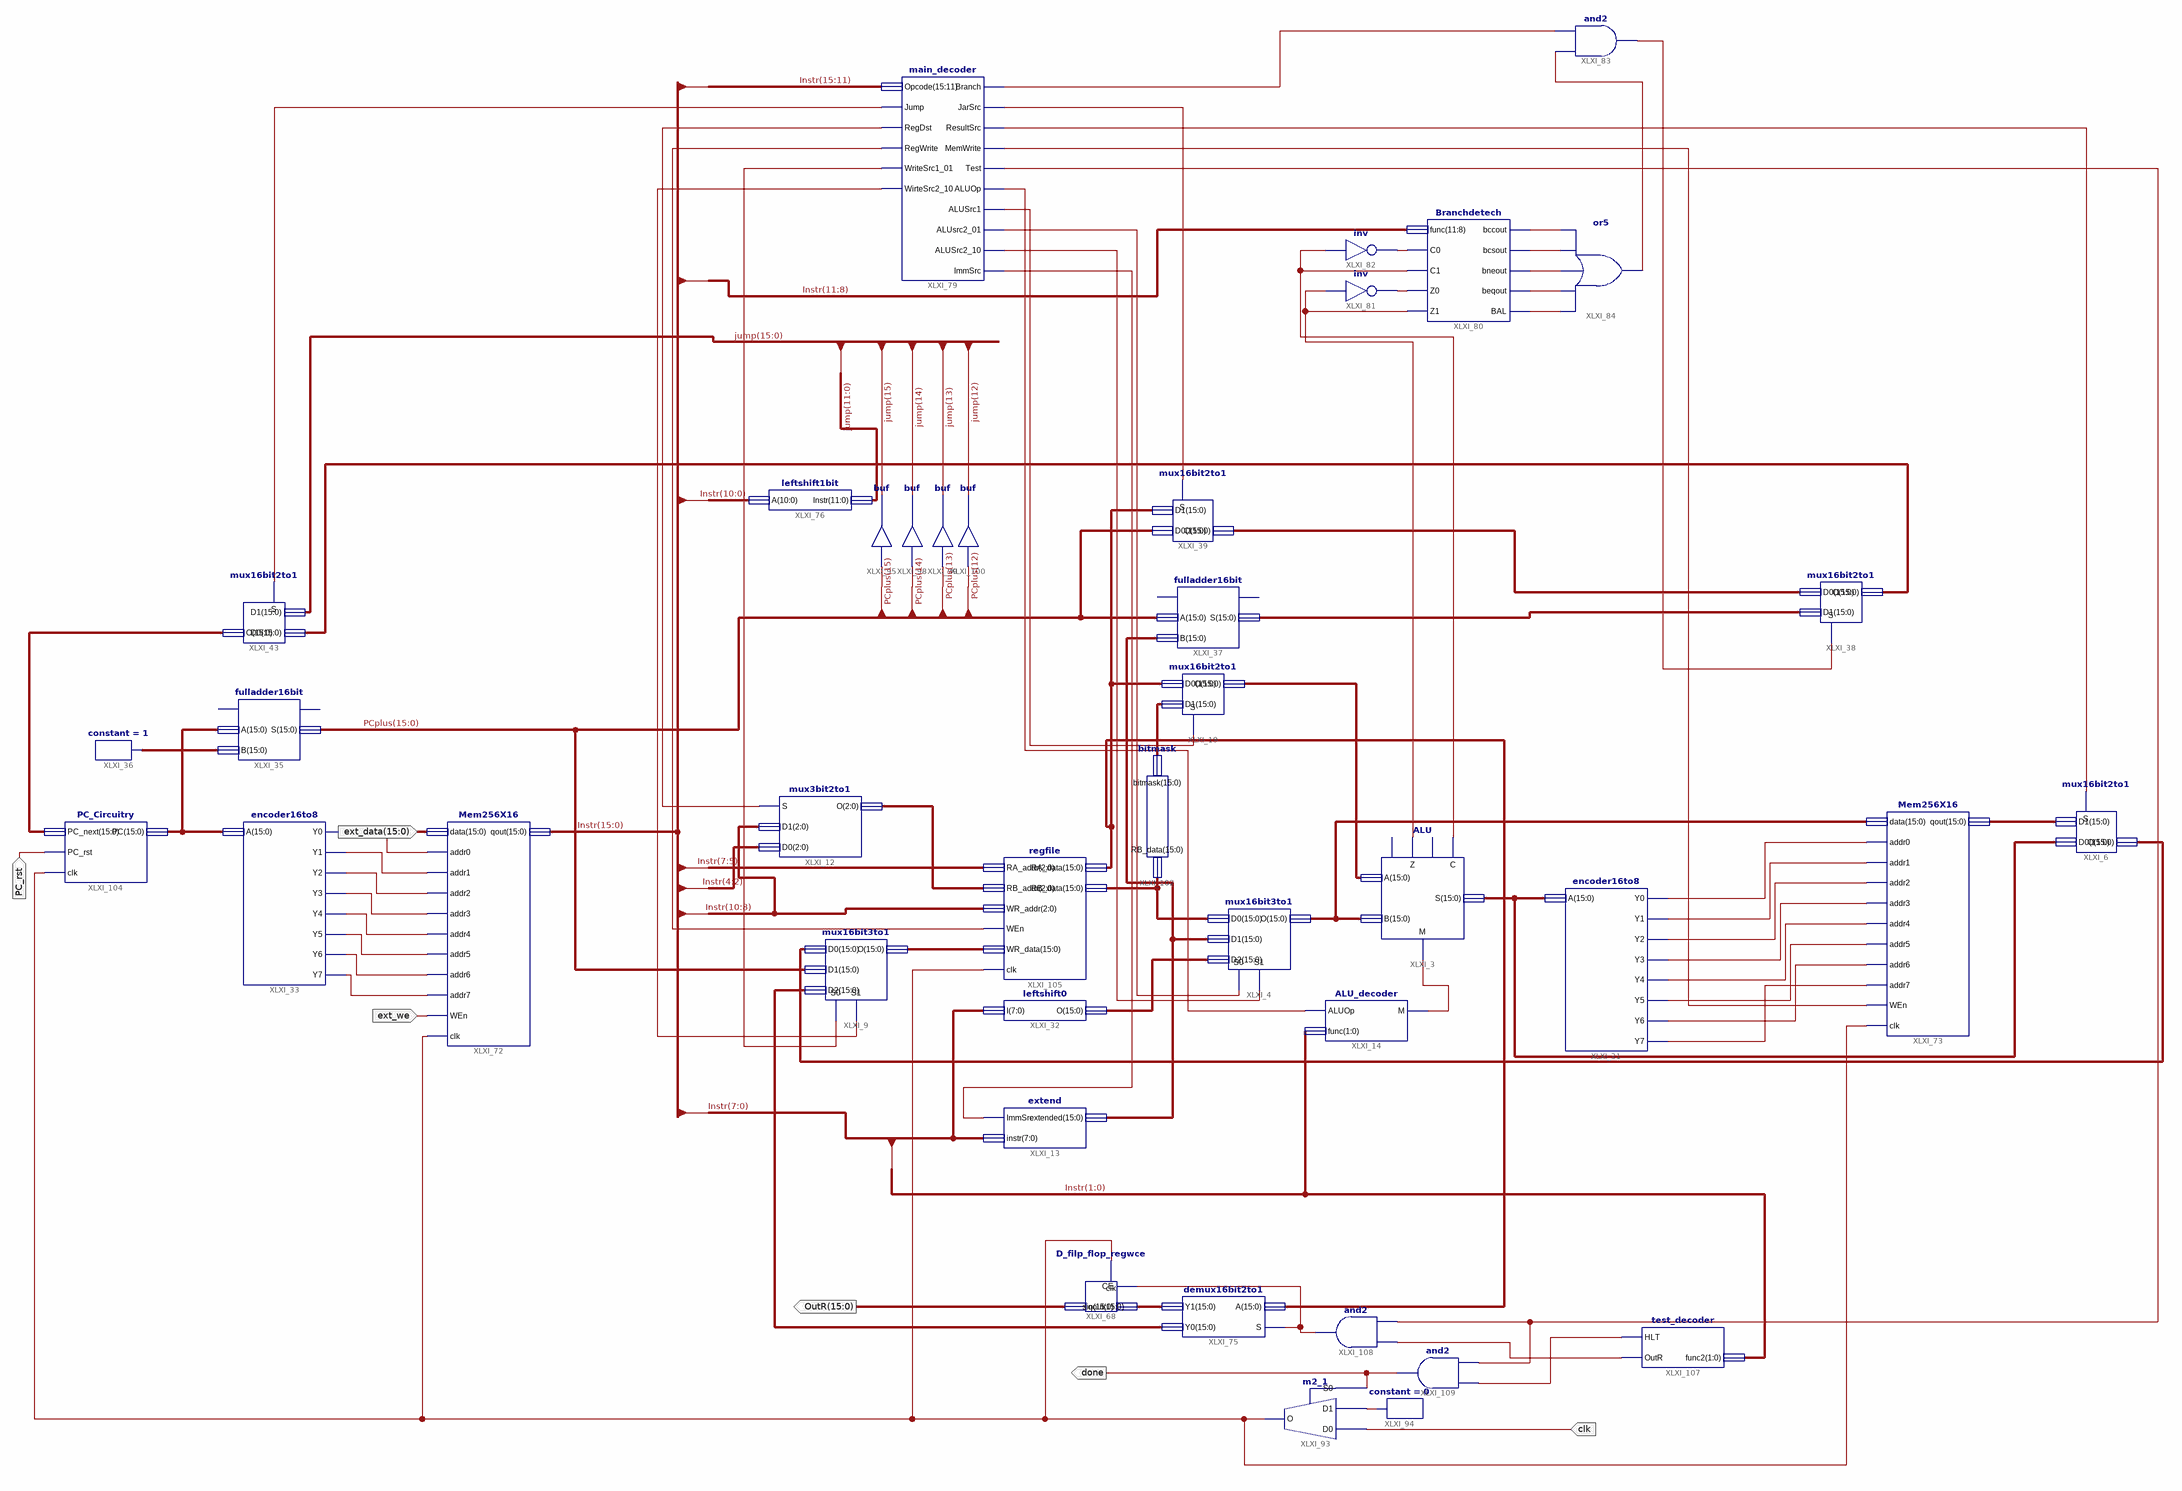
[diagram p0: schematic sheet 1]
// Xilinx ISE schematic RISCV16bit.sch (spartan3e) as structural Verilog: 40 symbols, 6 ports
module RISCV16bit (
  input  clk,
  input  [15:0] ext_data,
  input  PC_rst,
  input  ext_we,
  output done,
  output [15:0] OutR
);

  wire XLXN_18, XLXN_32, XLXN_33, XLXN_34, XLXN_35, XLXN_36, XLXN_37, XLXN_38, XLXN_39, XLXN_43, XLXN_44,
       XLXN_45, XLXN_46, XLXN_47, XLXN_48, XLXN_49, XLXN_50, XLXN_128, XLXN_130, XLXN_131, XLXN_132,
       XLXN_135, XLXN_136, XLXN_137, XLXN_138, XLXN_139, XLXN_140, XLXN_141, XLXN_146, XLXN_147, XLXN_148,
       XLXN_149, XLXN_150, XLXN_151, XLXN_152, XLXN_153, XLXN_154, XLXN_155, XLXN_156, XLXN_157, XLXN_158,
       XLXN_163, XLXN_196, XLXN_202, XLXN_218, XLXN_219, XLXN_220, XLXN_224;
  wire [2:0] XLXN_15;
  wire [15:0] Instr, jump, PCplus, XLXN_1, XLXN_2, XLXN_4, XLXN_5, XLXN_6, XLXN_7, XLXN_21, XLXN_41, XLXN_42,
       XLXN_52, XLXN_53, XLXN_57, XLXN_61, XLXN_63, XLXN_64, XLXN_114, XLXN_199, XLXN_203, XLXN_225;

  ALU XLXI_3 (.C(XLXN_148), .Z(XLXN_149), .M(XLXN_18), .S(XLXN_5), .B(XLXN_1), .A(XLXN_21));  // open: N, V
  mux16bit3to1 XLXI_4 (.D0(XLXN_2), .D1(XLXN_203), .D2(XLXN_41), .O(XLXN_1), .S0(XLXN_137), .S1(XLXN_138));
  mux16bit3to1 XLXI_9 (.D0(XLXN_7), .D1(PCplus), .D2(XLXN_225), .O(XLXN_6), .S0(XLXN_130), .S1(XLXN_131));
  mux3bit2to1 XLXI_12 (.D0(Instr[4:2]), .D1(Instr[10:8]), .O(XLXN_15), .S(XLXN_132));
  extend XLXI_13 (.extended(XLXN_203), .ImmSrc(XLXN_139), .instr(Instr[7:0]));
  ALU_decoder XLXI_14 (.ALUOp(XLXN_140), .func(Instr[1:0]), .M(XLXN_18));
  mux16bit2to1 XLXI_6 (.D0(XLXN_5), .D1(XLXN_4), .O(XLXN_7), .S(XLXN_158));
  encoder16to8 XLXI_31 (
    .A(XLXN_5), .Y0(XLXN_32), .Y1(XLXN_33), .Y2(XLXN_34), .Y3(XLXN_35), .Y4(XLXN_36), .Y5(XLXN_37),
    .Y6(XLXN_38), .Y7(XLXN_39));
  leftshift0 XLXI_32 (.I(Instr[7:0]), .O(XLXN_41));
  encoder16to8 XLXI_33 (
    .A(XLXN_42), .Y0(XLXN_43), .Y1(XLXN_44), .Y2(XLXN_45), .Y3(XLXN_46), .Y4(XLXN_47), .Y5(XLXN_48),
    .Y6(XLXN_49), .Y7(XLXN_50));
  mux16bit2to1 XLXI_19 (.D0(XLXN_53), .D1(XLXN_52), .O(XLXN_21), .S(XLXN_136));
  fulladder16bit XLXI_35 (.A(XLXN_42), .B(XLXN_57), .S(PCplus));  // open: cin, cout
  constant #(.CValue("1")) XLXI_36 (.O(XLXN_57));
  fulladder16bit XLXI_37 (.A(PCplus), .B(XLXN_203), .S(XLXN_61));  // open: cin, cout
  mux16bit2to1 XLXI_38 (.D0(XLXN_63), .D1(XLXN_61), .O(XLXN_64), .S(XLXN_157));
  mux16bit2to1 XLXI_39 (.D0(PCplus), .D1(XLXN_53), .O(XLXN_63), .S(XLXN_141));
  mux16bit2to1 XLXI_43 (.D0(XLXN_64), .D1(jump), .O(XLXN_199), .S(XLXN_128));
  D_filp_flop_regwce XLXI_68 (.CE(XLXN_220), .clk(XLXN_196), .qout(OutR), .sin(XLXN_114));
  Mem256X16 XLXI_72 (
    .addr0(XLXN_43), .addr1(XLXN_44), .addr2(XLXN_45), .addr3(XLXN_46), .addr4(XLXN_47), .addr5(XLXN_48),
    .addr6(XLXN_49), .addr7(XLXN_50), .clk(XLXN_196), .data(ext_data), .qout(Instr), .WEn(ext_we));
  Mem256X16 XLXI_73 (
    .addr0(XLXN_32), .addr1(XLXN_33), .addr2(XLXN_34), .addr3(XLXN_35), .addr4(XLXN_36), .addr5(XLXN_37),
    .addr6(XLXN_38), .addr7(XLXN_39), .clk(XLXN_196), .data(XLXN_1), .qout(XLXN_4), .WEn(XLXN_135));
  demux16bit2to1 XLXI_75 (.A(XLXN_53), .S(XLXN_220), .Y0(XLXN_225), .Y1(XLXN_114));
  leftshift1bit XLXI_76 (.A(Instr[10:0]), .Instr(jump[11:0]));
  main_decoder XLXI_79 (
    .Opcode(Instr[15:11]), .Jump(XLXN_128), .RegDst(XLXN_132), .RegWrite(XLXN_202), .Branch(XLXN_156),
    .JarSrc(XLXN_141), .ResultSrc(XLXN_158), .MemWrite(XLXN_135), .ALUOp(XLXN_140), .Test(XLXN_224),
    .ALUSrc1(XLXN_136), .ALUSrc2_10(XLXN_138), .ALUsrc2_01(XLXN_137), .WriteSrc1_01(XLXN_130),
    .WirteSrc2_10(XLXN_131), .ImmSrc(XLXN_139));
  Branchdetech XLXI_80 (
    .BAL(XLXN_150), .bccout(XLXN_154), .bcsout(XLXN_153), .beqout(XLXN_151), .bneout(XLXN_152),
    .C0(XLXN_147), .C1(XLXN_148), .func(Instr[11:8]), .Z0(XLXN_146), .Z1(XLXN_149));
  not XLXI_81 (XLXN_146, XLXN_149);
  not XLXI_82 (XLXN_147, XLXN_148);
  and XLXI_83 (XLXN_157, XLXN_155, XLXN_156);
  or XLXI_84 (XLXN_155, XLXN_150, XLXN_151, XLXN_152, XLXN_153, XLXN_154);
  m2_1 XLXI_93 (.D0(clk), .D1(XLXN_163), .S0(done), .O(XLXN_196));
  constant #(.CValue("0")) XLXI_94 (.O(XLXN_163));
  buf XLXI_95 (jump[15], PCplus[15]);
  buf XLXI_98 (jump[14], PCplus[14]);
  buf XLXI_99 (jump[13], PCplus[13]);
  buf XLXI_100 (jump[12], PCplus[12]);
  bitmask XLXI_102 (.bitmask(XLXN_52), .RB_data(XLXN_2));
  PC_Circuitry XLXI_104 (.clk(XLXN_196), .PC(XLXN_42), .PC_next(XLXN_199), .PC_rst(PC_rst));
  regfile XLXI_105 (
    .RA_addr(Instr[7:5]), .RB_addr(XLXN_15), .WR_addr(Instr[10:8]), .WEn(XLXN_202), .WR_data(XLXN_6),
    .clk(XLXN_196), .RA_data(XLXN_53), .RB_data(XLXN_2));
  test_decoder XLXI_107 (.func2(Instr[1:0]), .HLT(XLXN_218), .OutR(XLXN_219));
  and XLXI_108 (XLXN_220, XLXN_224, XLXN_219);
  and XLXI_109 (done, XLXN_224, XLXN_218);
endmodule
